# EAGLE design AVR_mainboardV11 (EAGLE 5.07)
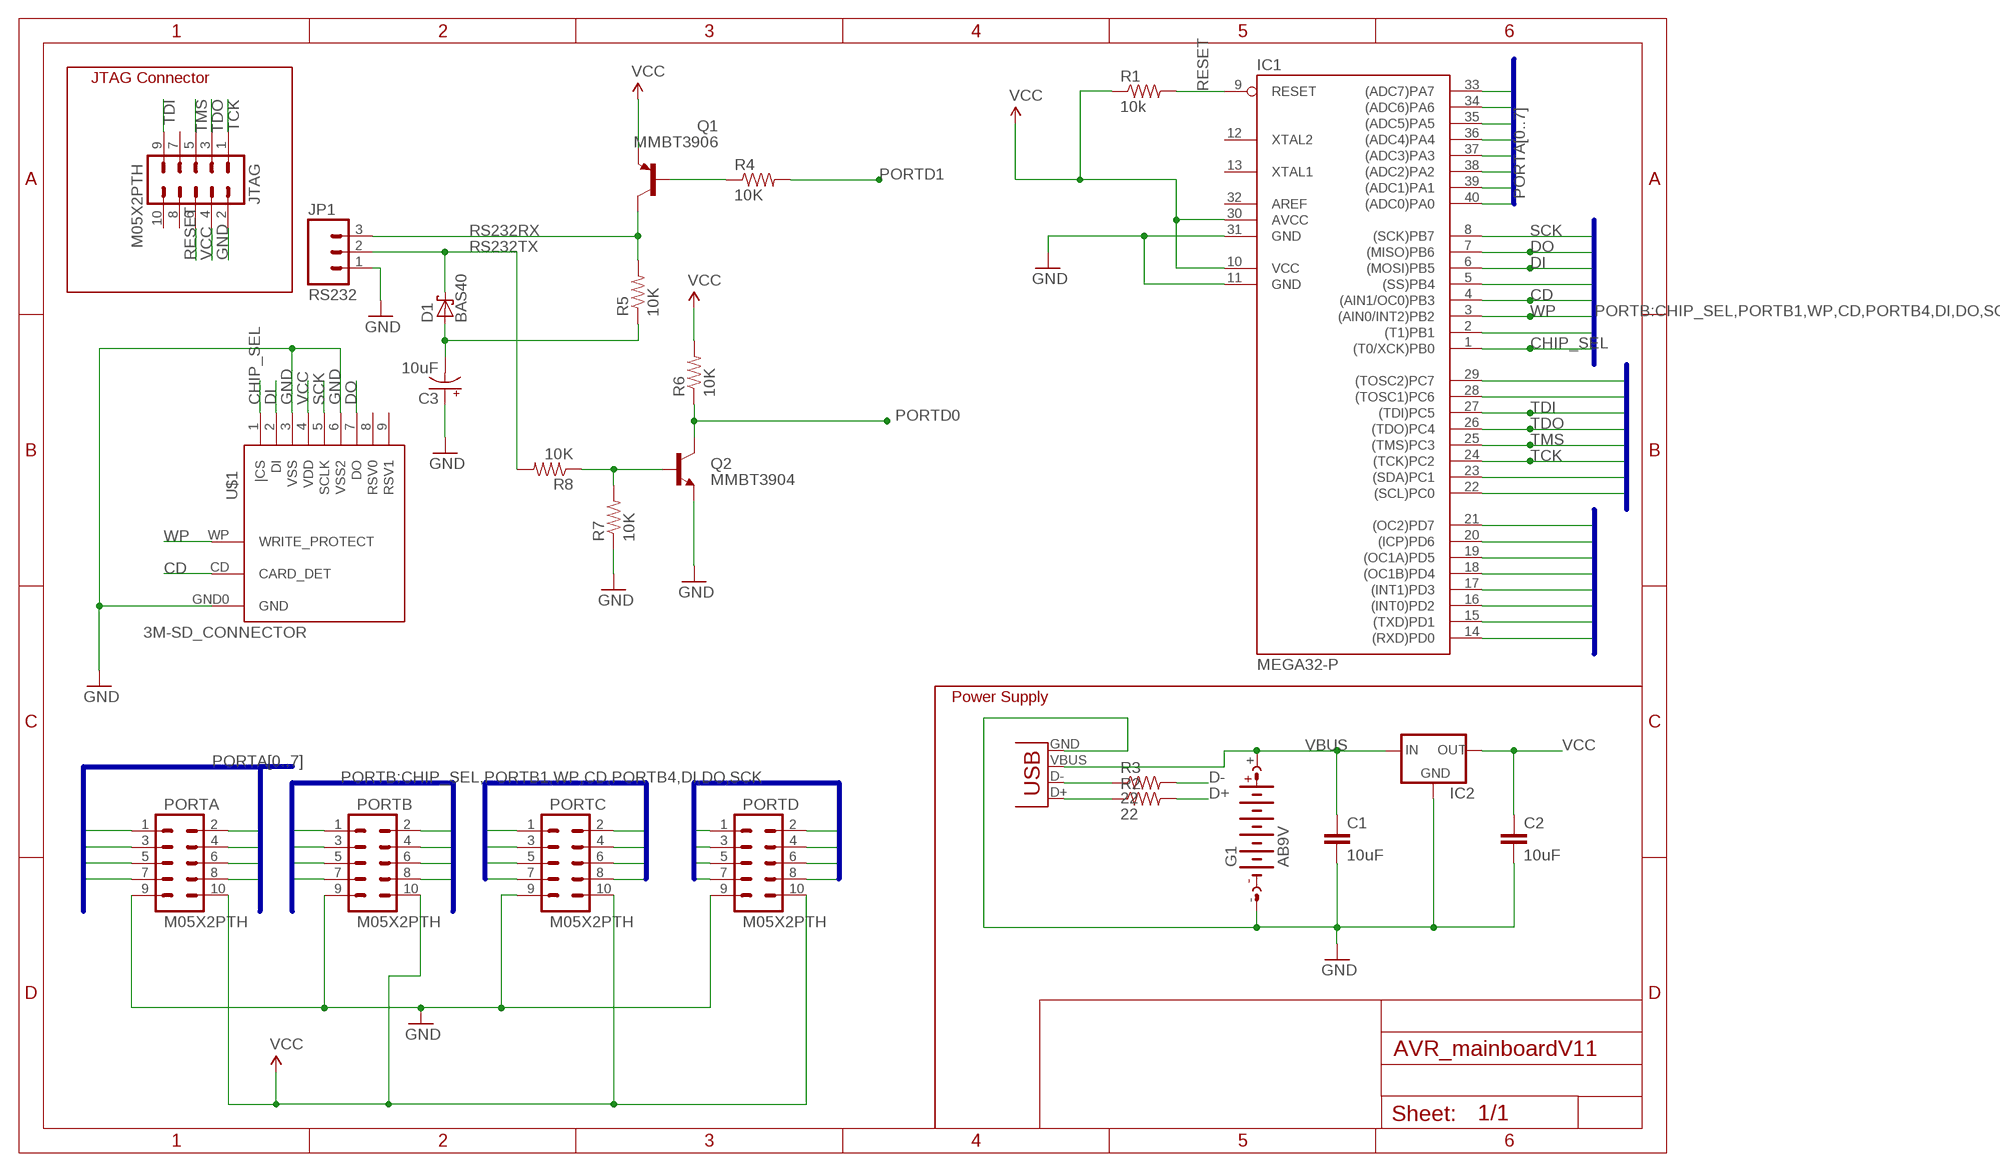
[diagram p0: schematic, sheet 1]

## Parts
C1  10uF  CAPSMD  [GRM43D]
C2  10uF  CAPSMD  [GRM43D]
C3  10uF  CAP_POLPTH2  [CPOL-RADIAL-10UF-25V]
D1  BAS40  [SOT23]
G1  AB9V  [AB9V]
IC1  MEGA32-P  [DIL40]
IC2  3.3V-REGULATOR  [TO220]
JP1  RS232  M03PTH  [1X03]
JTAG  M05X2PTH  [AVR_ICSP]
PORTA  M05X2PTH  [AVR_ICSP]
PORTB  M05X2PTH  [AVR_ICSP]
PORTC  M05X2PTH  [AVR_ICSP]
PORTD  M05X2PTH  [AVR_ICSP]
Q1  MMBT3906  MMBT3906LT1SMD  [SOT23-BEC]
Q2  MMBT3904  TRANSISTOR_NPNSOT23  [SOT23]
R1  10k  RESISTOR1206  [1206]
R2  22  RESISTOR  [0805]
R3  22  RESISTOR  [0805]
R4  10K  RESISTOR1206  [1206]
R5  10K  RESISTOR1206  [1206]
R6  10K  RESISTOR1206  [1206]
R7  10K  RESISTOR1206  [1206]
R8  10K  RESISTOR1206  [1206]
U$1  3M-SD_CONNECTOR  [3M-HC07814A]
X1  USBPTH  [USB-B-PTH]

## Nets
CD: IC1.4((AIN1/OC0)PB3) PORTB.4 U$1.CD(CARD_DET)
CHIP_SEL: IC1.1((T0/XCK)PB0) PORTB.1 U$1.1(|CS)
D+: R2.2
D+.: R2.1 X1.D+
D-: R3.2
D-.: R3.1 X1.D-
DI: IC1.6((MOSI)PB5) PORTB.6 U$1.2(DI)
DO: IC1.7((MISO)PB6) PORTB.7 U$1.7(DO)
GND: C1.C C2.C C3.1(+) G1.- IC1.11(GND) IC1.31(GND) IC2.1(GND) JP1.1 JTAG.2 PORTA.9 PORTB.9 PORTC.9 PORTD.9 Q2.2(E) R7.1 U$1.3(VSS) U$1.6(VSS2) U$1.GND0(GND) X1.GND
N$1: Q1.B R4.1
N$2: Q2.1(B) R7.2 R8.1
N$3: C3.2(-) D1.1(A) R5.1
PORTA0: IC1.40((ADC0)PA0) PORTA.1
PORTA1: IC1.39((ADC1)PA1) PORTA.2
PORTA2: IC1.38((ADC2)PA2) PORTA.3
PORTA3: IC1.37((ADC3)PA3) PORTA.4
PORTA4: IC1.36((ADC4)PA4) PORTA.5
PORTA5: IC1.35((ADC5)PA5) PORTA.6
PORTA6: IC1.34((ADC6)PA6) PORTA.7
PORTA7: IC1.33((ADC7)PA7) PORTA.8
PORTB1: IC1.2((T1)PB1) PORTB.2
PORTB4: IC1.5((SS)PB4) PORTB.5
PORTC0: IC1.22((SCL)PC0) PORTC.1
PORTC1: IC1.23((SDA)PC1) PORTC.2
PORTC6: IC1.28((TOSC1)PC6) PORTC.7
PORTC7: IC1.29((TOSC2)PC7) PORTC.8
PORTD0: IC1.14((RXD)PD0) PORTD.1 Q2.3(C) R6.1
PORTD1: IC1.15((TXD)PD1) PORTD.2 R4.2
PORTD2: IC1.16((INT0)PD2) PORTD.3
PORTD3: IC1.17((INT1)PD3) PORTD.4
PORTD4: IC1.18((OC1B)PD4) PORTD.5
PORTD5: IC1.19((OC1A)PD5) PORTD.6
PORTD6: IC1.20((ICP)PD6) PORTD.7
PORTD7: IC1.21((OC2)PD7) PORTD.8
RESET: IC1.9(RESET) JTAG.6 R1.2
RS232RX: JP1.3 Q1.C R5.2
RS232TX: D1.3(C) JP1.2 R8.2
SCK: IC1.8((SCK)PB7) PORTB.8 U$1.5(SCLK)
TCK: IC1.24((TCK)PC2) JTAG.1 PORTC.3
TDI: IC1.27((TDI)PC5) JTAG.9 PORTC.6
TDO: IC1.26((TDO)PC4) JTAG.3 PORTC.5
TMS: IC1.25((TMS)PC3) JTAG.5 PORTC.4
VBUS: C1.A G1.+ IC2.3(IN) X1.VBUS
VCC: C2.A IC1.10(VCC) IC1.30(AVCC) IC2.2(OUT) JTAG.4 PORTA.10 PORTB.10 PORTC.10 PORTD.10 Q1.E R1.1 R6.2 U$1.4(VDD)
WP: IC1.3((AIN0/INT2)PB2) PORTB.3 U$1.WP(WRITE_PROTECT)
Unconnected: IC1.12(XTAL2) IC1.13(XTAL1) IC1.32(AREF) JTAG.7 JTAG.8 JTAG.10 U$1.8(RSV0) U$1.9(RSV1)

## Buses
PORTA[0..7]
PORTB:CHIP_SEL,PORTB1,WP,CD,PORTB4,DI,DO,SCK
PORTC:PORTC0,PORTC1,TCK,TMS,TDO,TDI,PORTC6,PORTC7
PORTD[0..7]

## Notes on the sheet
- JTAG Connector
- Power Supply

## Library data of the parts
C1 C2 = SparkFun:CAP: Capacitor Standard 0603 ceramic capacitor, and 0.1" leaded capacitor.
C3 = SparkFun:CAP_POL: Capacitor Polarized These are standard SMD and PTH capacitors. Normally 10uF, 47uF, and 100uF in electrolytic and tantalum varieties. Always verify the external diameter of the through hole cap, it varies with capacity, voltage, and manufacturer. The EIA devices should be standard.
D1 = diode:BAS40: Silicon Schottky Diodes General-purpose diode for high-speed switching
G1 = battery:AB9V: 9-V BATTERY CLIP
IC1 = atmel:MEGA32-P: MICROCONTROLLER 32 Kbytes FLASH 2 Kbytes SRAM 1 Kbytes EEPROM USART 8-channel 10 bit ADC Source: www.atmel.com .. doc2503.pdf
IC2 = SparkFun:3.3V-REGULATOR
JP1 = SparkFun:M03: Header 3 Standard 3-pin 0.1" header. Use with straight break away headers (SKU : PRT-00116), right angle break away headers (PRT-00553), swiss pins (PRT-00743), machine pins (PRT-00117), and female headers (PRT-00115). Molex polarized connector foot print use with SKU : PRT-08232 with associated crimp pins and housings.
JTAG PORTA PORTB PORTC PORTD = SparkFun:M05X2: Header 5x2 Standard 10-pin dual row 0.1" header. Commonly used with AVR-ISP. Use with Spark Fun Electronics SKU: PRT-00778
Q1 = transistor-pnp:MMBT3906*: PNP Transistror
Q2 = SparkFun:TRANSISTOR_NPN: Transistor NPN BJT configuration in SOT23 package. MMBT2222 is the common NPN we use. Double check BCE configuration again layout.
R1-R8 = SparkFun:RESISTOR: Resistor Basic schematic elements and footprints for 0603, 1206, and PTH 1/10th watt (small) resistors.
U$1 = ivar:3M-SD_CONNECTOR
X1 = SparkFun:USB: USB Connectors USB-B-PTH is fully proven SKU : PRT-00139 USB-miniB is fully proven SKU : PRT-00587 USB-A-PCB is untested. USB-A-H is throughly reviewed, but untested. Spark Fun Electronics SKU : PRT-00437 USB-B-SMT is throughly reviewed, but untested. Needs silkscreen touching up. USB-A-S has not been used/tested USB-MB-H has not been used/tested

## Board
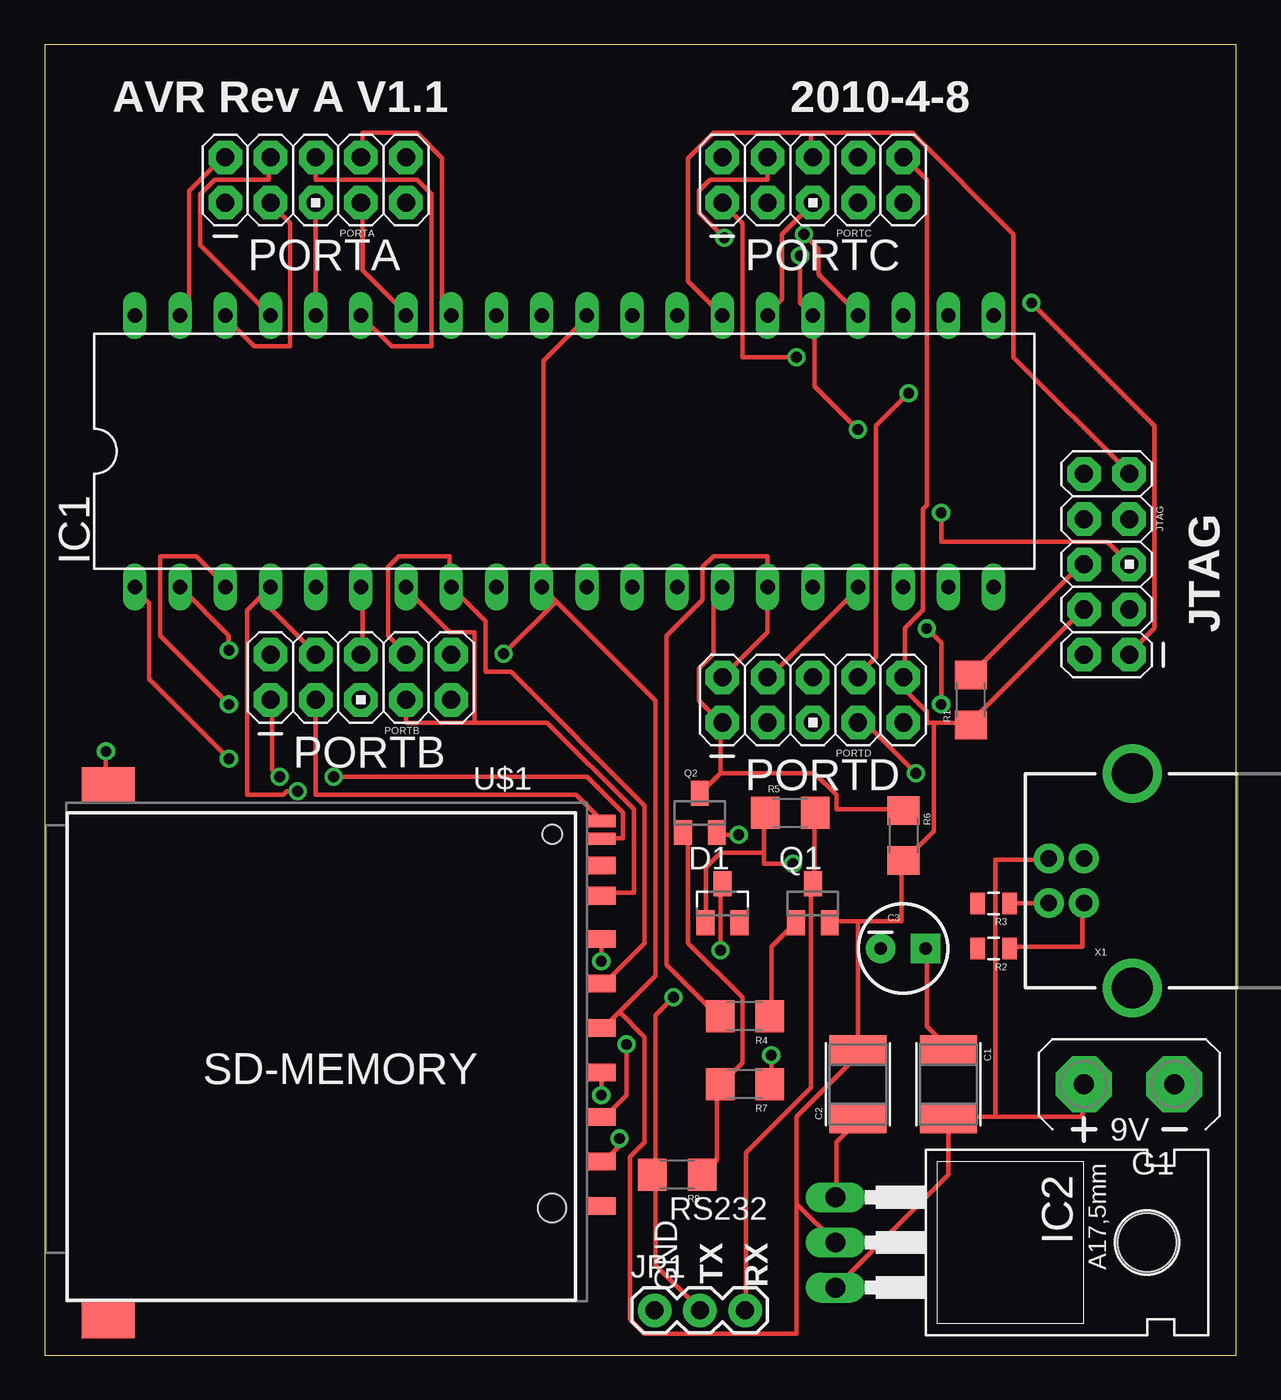
[diagram p1: board, top side]
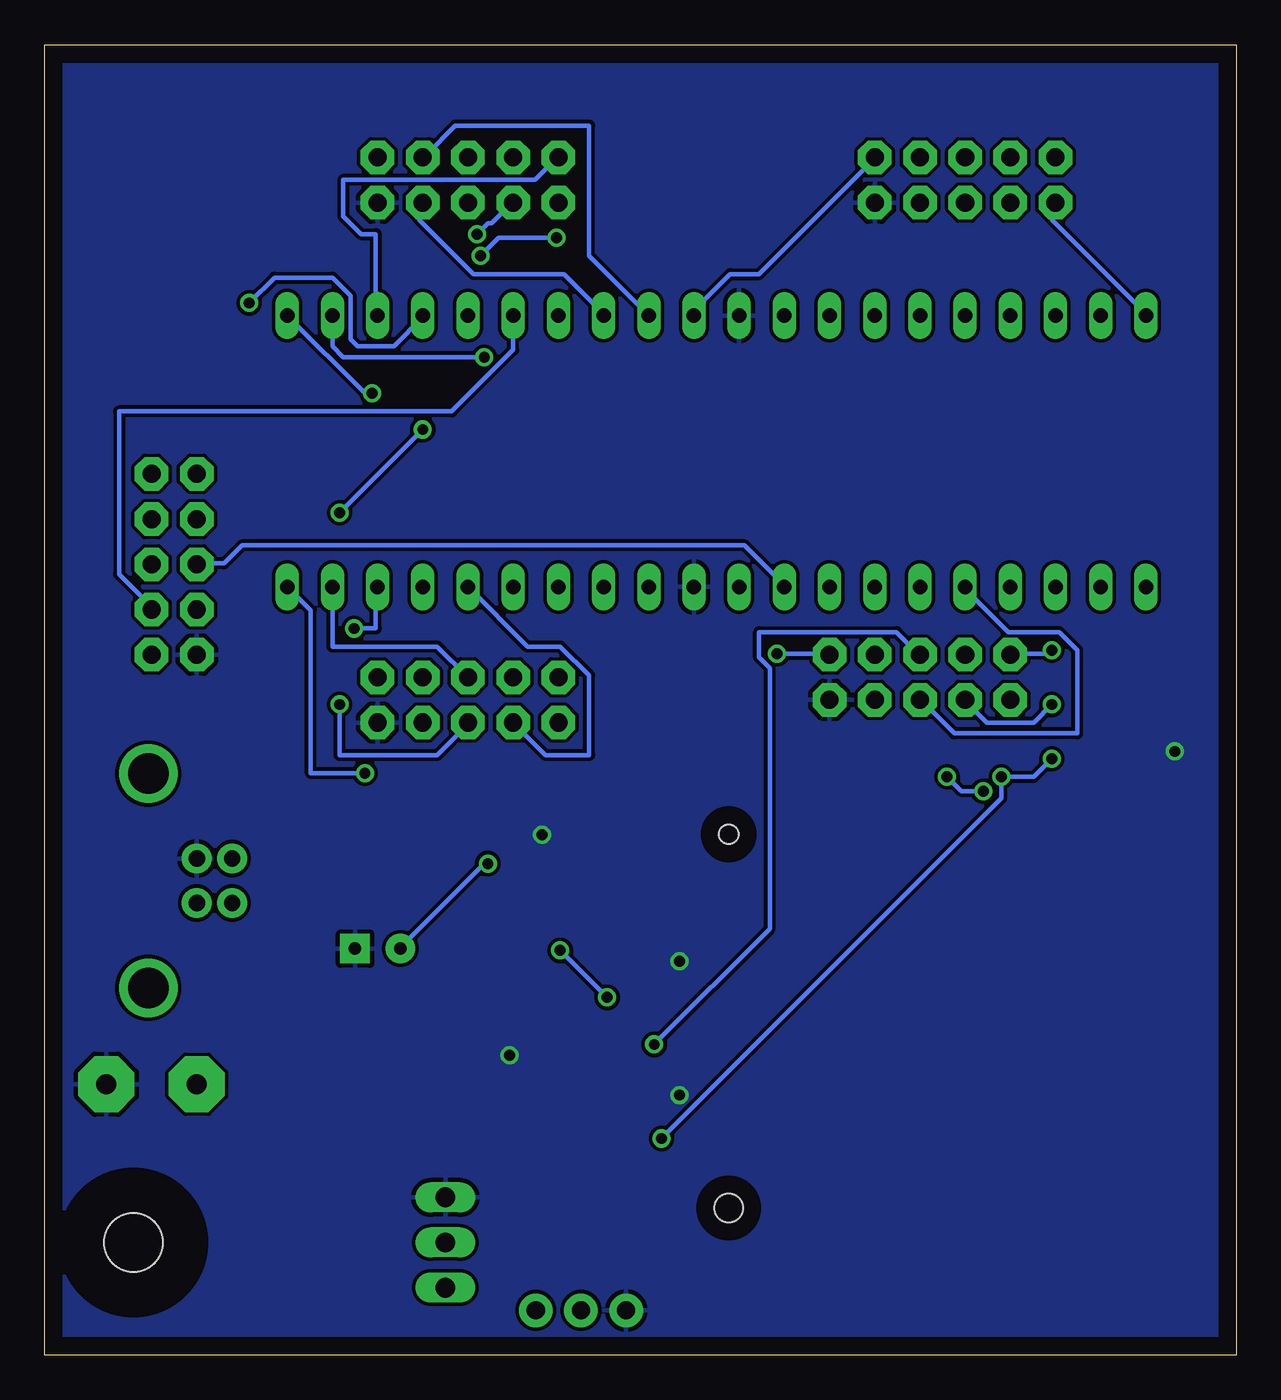
[diagram p2: board, bottom side, seen from below]

Size 66.98 x 73.65 mm. Coordinates in mm from the lower left corner, seen from the top.
Outline: 0,0 66.98,0 66.98,73.65 0,73.65 0,0
Copper layers (1*16): Top 0.035mm / dielectric 1.5mm / Bottom 0.035mm
Design rules "default": minimum track width 10mil, minimum drill 24mil, track to track 8mil, track to pad 8mil, pad to pad 8mil, via to via 8mil, smd to smd 8mil, copper to edge 40mil, drill to drill 8mil, minimum pad ring 10mil, minimum via ring 8mil, stop-mask expansion 4mil, vias tented up to drill 0mil, thermal gap 10mil

### Footprints (pad centres in the part's own frame; a part is rotated, then mirrored left to right if it is on the bottom)
GRM43D = smd 1.65 x 3.2: A 1.927,0; C -1.927,0
CPOL-RADIAL-10UF-25V = drill 0.7 pad 1.651 square: 1 1.27,0 | drill 0.7 pad 1.651 round: 2 -1.27,0
SOT23 = smd 1 x 1.4: 1 -0.95,-1.1; 2 0.95,-1.1; 3 0,1.1
AB9V = drill 1.118 pad 3.15 octagon: + 0,2.54; - 0,-2.54
DIL40 = drill 0.813 long: 1 -24.13,-7.62; 2 -21.59,-7.62; 3 -19.05,-7.62; 4 -16.51,-7.62; 5 -13.97,-7.62; 6 -11.43,-7.62; 7 -8.89,-7.62; 8 -6.35,-7.62; 9 -3.81,-7.62; 10 -1.27,-7.62; 11 1.27,-7.62; 12 3.81,-7.62; 13 6.35,-7.62; 14 8.89,-7.62; 15 11.43,-7.62; 16 13.97,-7.62; 17 16.51,-7.62; 18 19.05,-7.62; 19 21.59,-7.62; 20 24.13,-7.62; 21 24.13,7.62; 22 21.59,7.62; 23 19.05,7.62; 24 16.51,7.62; 25 13.97,7.62; 26 11.43,7.62; 27 8.89,7.62; 28 6.35,7.62; 29 3.81,7.62; 30 1.27,7.62; 31 -1.27,7.62; 32 -3.81,7.62; 33 -6.35,7.62; 34 -8.89,7.62; 35 -11.43,7.62; 36 -13.97,7.62; 37 -16.51,7.62; 38 -19.05,7.62; 39 -21.59,7.62; 40 -24.13,7.62
TO220 = drill 1.118 long: 1 -2.54,-6.35; 2 0,-6.35; 3 2.54,-6.35 | hole 3.302: 0,11.176
1X03 = drill 1.016 pad 1.88 round: 1 0,0; 2 2.54,0; 3 5.08,0
AVR_ICSP = drill 1.016 pad 1.88 octagon: 1 -1.27,5.08; 2 1.27,5.08; 3 -1.27,2.54; 4 1.27,2.54; 5 -1.27,0; 6 1.27,0; 7 -1.27,-2.54; 8 1.27,-2.54; 9 -1.27,-5.08; 10 1.27,-5.08
SOT23-BEC = smd 1 x 1.4: B -0.95,-1.1; C 0,1.1; E 0.95,-1.1
1206 = smd 1.6 x 1.8: 1 -1.4,0; 2 1.4,0
0805 = smd 0.8 x 1.2: 1 -0.9,0; 2 0.9,0
3M-HC07814A = smd 1 x 1.5: 1 6.88,26.25; 2 4.38,26.25; 3 1.88,26.25; 4 -0.62,26.25; 5 -3.12,26.25; 6 -5.62,26.25; 7 -8.05,26.25; 8 -9.75,26.25; 9 9.38,26.25 | smd 0.7 x 1.5: CD -11.25,26.25; WP -12.25,26.25 | smd 2 x 3: GND0 -14.28,-1.5; GND1 15.82,-1.5 | hole 1.1: -11.5,23.45 | hole 1.6: 9.5,23.45
USB-B-PTH = drill 0.914 pad 1.676 round: D+ 0,1.25; D- 1.981,1.25; GND 0,-1.25; VBUS 1.981,-1.25 | drill 2.286 round: P$1 -2.718,-6.02; P$2 -2.718,6.02

### Placement (x,y rotation side)
C1  50.8,15.24 270 top
C2  45.72,15.24 90 top
C3  48.26,22.86 0 top
D1  38.1,25.4 0 top
G1  60.96,15.24 90 top
IC1  29.21,50.8 0 top
IC2  50.8,6.35 270 top
JP1  34.29,2.54 0 top
JTAG  59.69,44.45 180 top
PORTA  15.24,66.04 90 top
PORTB  17.78,38.1 90 top
PORTC  43.18,66.04 90 top
PORTD  43.18,36.83 90 top
Q1  43.18,25.4 0 top
Q2  36.83,30.48 0 top
R1  52.07,36.83 90 top
R2  53.34,22.86 180 top
R3  53.34,25.4 180 top
R4  39.37,19.05 180 top
R5  41.91,30.48 0 top
R6  48.26,29.21 270 top
R7  39.37,15.24 180 top
R8  35.56,10.16 180 top
U$1  5.08,17.78 270 top
X1  58.42,26.67 180 top

### Tracks (layer width: path | path; a pad name or v marks a point on that pad's centre or on a via)
CD  (via drill 0.61)
  Top 0.254: v16.26,32.51 30.48,32.51 32.51,30.48 32.51,29.06 31.5,29.06 U$1.CD | v14.22,31.7 13.61,31.7 13.41,31.5 11.38,31.5 11.38,41.86 12.19,42.67 | 12.19,42.67 IC1.4 12.6,43.08 | 12.19,42.67 12.19,42.47 15.24,39.42 PORTB.4
  Bottom 0.254: v16.26,32.51 15.44,31.7 v14.22,31.7
CHIP_SEL  (via drill 0.61)
  Top 0.254: v32.31,12.19 32.31,11.79 31.5,10.97 U$1.1 | v13.21,32.51 12.8,32.92 12.8,36.78 PORTB.1 | v10.36,33.53 5.89,38 5.89,42.27 5.08,43.08 IC1.1
  Bottom 0.254: v32.31,12.19 13.21,31.29 v13.21,32.51 11.38,32.51 v10.36,33.53
D+.
  Top 0.254: R2.1 54.25,22.96 58.32,22.96 58.32,25.4 X1.D+
D-.
  Top 0.254: R3.1 56.29,25.4 X1.D-
DI  (via drill 0.61)
  Top 0.254: v32.72,17.48 32.72,14.63 31.5,13.41 U$1.2 | IC1.6 17.88,43.08 17.88,39.42 PORTB.6
  Bottom 0.254: v32.72,17.48 26.21,23.98 26.21,38.61 26.82,39.22 26.82,40.64 19.1,40.64 17.88,39.42 PORTB.6
DO
  Top 0.254: 24.18,35.56 20.32,35.56 PORTB.7 | 24.18,35.56 28.25,35.56 33.12,30.68 33.12,26.01 31.5,26.01 U$1.7 | 24.18,35.56 24.18,40.64 22.76,40.64 20.32,43.08 IC1.7
GND  (via drill 0.61)
  Top 0.254: v39.01,29.26 37.8,29.26 Q2.2 | v31.29,14.63 31.29,15.85 U$1.3 | v31.29,22.15 31.29,23.37 U$1.6 | v40.84,16.87 40.84,15.24 R7.1 | v3.45,33.93 3.45,32.11 U$1.GND0 | C2.C 45.72,13.21 44.5,11.99 44.5,8.94 IC2.1 | C1.C 50.8,17.27 49.58,18.49 49.58,22.76 C3.1
  pour Bottom: 0,73.66 67.31,73.66 67.31,0 0,0
N$1
  Top 0.254: Q1.B 42.06,24.18 40.84,22.96 40.84,19.1 R4.1
N$2
  Top 0.254: Q2.1 35.97,29.26 36.17,29.06 36.17,23.16 39.22,20.12 39.22,16.46 38,15.24 R7.2 37.8,15.24 37.8,10.97 36.98,10.16 R8.1
N$3  (via drill 0.61)
  Top 0.254: 40.44,28.25 38,28.25 37.19,27.43 37.19,24.38 D1.1 | 40.44,28.25 40.44,30.48 R5.1 | v42.06,27.64 40.44,27.64 40.44,28.25
  Bottom 0.254: v42.06,27.64 42.27,27.64 46.94,22.96 C3.2
PORTA0
  Bottom 0.254: IC1.40 5.08,58.52 10.36,63.8 10.36,64.62 10.16,64.62 PORTA.1
PORTA1
  Top 0.254: IC1.39 8.13,58.93 8.13,65.43 10.16,67.46 PORTA.2
PORTA2
  Top 0.254: IC1.38 10.16,58.32 11.79,56.69 13.82,56.69 13.82,63.6 12.8,64.62 PORTA.3
PORTA3
  Top 0.254: IC1.37 8.74,62.38 8.74,65.23 9.55,66.04 12.6,66.04 12.6,67.26 PORTA.4
PORTA4
  Top 0.254: IC1.36 PORTA.5
PORTA5
  Top 0.254: IC1.35 19.51,56.69 21.74,56.69 21.74,65.23 20.93,66.04 15.24,66.04 PORTA.6
PORTA6
  Top 0.254: IC1.34 20.32,58.52 17.88,60.96 17.88,64.62 PORTA.7
PORTA7
  Top 0.254: IC1.33 22.35,58.93 22.35,67.26 20.93,68.68 17.88,68.68 17.88,67.46 PORTA.8
PORTB1  (via drill 0.61)
  Top 0.254: v10.36,39.62 10.36,40.44 IC1.2
  Bottom 0.254: v10.36,39.62 10.57,39.42 12.6,39.42 PORTB.2
PORTB4
  Bottom 0.254: IC1.5 15.24,43.08 12.8,40.64 9.96,40.64 8.94,39.62 8.94,34.95 15.85,34.95 17.68,36.78 PORTB.5
PORTC0  (via drill 0.61)
  Top 0.254: v42.27,56.08 39.22,56.08 39.22,63.6 38.2,64.62 PORTC.1
  Bottom 0.254: v42.27,56.08 50.19,56.08 50.8,56.69 IC1.22
PORTC1
  Bottom 0.254: IC1.23 48.36,58.52 48.36,62.99 49.17,62.99 50.19,64.01 50.19,66.04 39.42,66.04 38.2,67.26 PORTC.2
PORTC6
  Bottom 0.254: IC1.28 35.56,58.52 37.8,60.76 42.88,60.76 45.92,63.8 45.92,64.62 45.72,64.62 PORTC.7
PORTC7
  Bottom 0.254: IC1.29 36.37,61.77 36.37,69.09 43.89,69.09 45.52,67.46 45.72,67.46 PORTC.8
PORTD0
  Top 0.254: 38,32.72 36.98,31.7 Q2.3 | 38,32.72 38,35.56 | 38,32.72 43.28,32.72 44.5,31.5 44.5,30.68 48.16,30.68 R6.1 | 38,35.56 36.78,36.78 36.78,38.61 37.59,39.42 37.59,42.67 IC1.14 | 38,35.56 PORTD.1
PORTD1
  Top 0.254: R4.2 37.8,19.1 34.95,21.95 34.95,40.44 36.98,42.47 36.98,44.3 37.59,44.91 40.64,44.91 IC1.15 40.64,40.64 PORTD.2
PORTD2
  Bottom 0.254: PORTD.3 38.81,33.73 36.37,33.73 36.37,38.2 38,39.83 39.83,39.83 IC1.16
PORTD3
  Top 0.254: IC1.17 45.72,43.08 40.64,38 PORTD.4
PORTD4  (via drill 0.61)
  Top 0.254: v49.58,40.84 50.39,40.03 v50.39,36.58
  Bottom 0.254: v49.58,40.84 48.36,40.84 48.36,43.08 IC1.18 | v50.39,36.58 50.39,33.73 44.91,33.73 43.08,35.56 PORTD.5
PORTD5
  Bottom 0.254: IC1.19 50.8,39.83 44.91,39.83 PORTD.6
PORTD6  (via drill 0.61)
  Top 0.254: v48.97,32.72 46.13,35.56 PORTD.7
  Bottom 0.254: v48.97,32.72 52.02,32.72 52.02,41.86 IC1.20
PORTD7  (via drill 0.61)
  Top 0.254: v48.56,54.05 46.74,52.22 46.74,39.22 45.72,38.2 PORTD.8
  Bottom 0.254: v48.56,54.05 48.97,54.05 IC1.21
RESET
  Top 0.254: R1.2 52.22,38.41 58.32,44.5 JTAG.6
  Bottom 0.254: IC1.9 25.4,43.28 27.64,45.52 55.88,45.52 56.9,44.5 58.32,44.5 JTAG.6
RS232RX
  Top 0.254: R5.2 43.28,30.48 43.28,26.62 Q1.C 43.08,26.42 43.08,15.04 39.42,11.38 39.42,2.64 JP1.3
RS232TX  (via drill 0.61)
  Top 0.254: v38,22.76 38,26.42 D1.3 | v35.36,20.12 34.34,19.1 34.34,10.16 | 34.34,10.16 34.34,5.08 36.78,2.64 JP1.2 | 34.34,10.16 R8.2
  Bottom 0.254: v35.36,20.12 v38,22.76
SCK
  Top 0.254: U$1.5 31.5,20.93 33.73,23.16 33.73,30.89 26.21,38.41 24.79,38.41 24.79,41.25 IC1.8 22.76,43.28 22.76,44.91 19.91,44.91 19.3,44.3 19.3,40.44 20.32,39.42 PORTB.8
TCK  (via drill 0.61)
  Top 0.254: v42.67,62.99 43.48,62.18 43.48,60.76 45.72,58.52 IC1.24 | v55.47,59.13 62.38,52.22 62.38,40.84 60.96,39.42 JTAG.1
  Bottom 0.254: v42.67,62.99 42.06,63.6 41.86,63.6 40.84,64.62 40.64,64.62 PORTC.3 | v55.47,59.13 54.05,60.55 50.8,60.55 49.78,59.54 49.78,57.1 49.38,56.69 47.35,56.69 45.72,58.32 IC1.24
TDI
  Top 0.254: 43.08,68.68 37.59,68.68 36.17,67.26 36.17,60.35 IC1.27 | 43.08,68.68 43.08,67.46 PORTC.6 | 43.08,68.68 48.77,68.68 54.46,62.99 54.46,56.08 60.96,49.58 JTAG.9
TDO
  Top 0.254: IC1.26 40.64,58.52 41.45,59.33 41.45,62.99 43.08,64.62 PORTC.5
  Bottom 0.254: JTAG.3 60.96,42.06 62.79,43.89 62.79,53.03 44.09,53.03 40.64,56.49 IC1.26
TMS  (via drill 0.61)
  Top 0.254: v42.47,61.77 42.47,59.13 IC1.25 43.28,58.32 43.28,54.46 v45.72,52.02 | v38.2,62.79 36.78,64.21 36.78,65.43 37.39,66.04 40.64,66.04 PORTC.4 | v50.39,47.35 50.39,45.72 59.74,45.72 60.96,44.5 JTAG.5
  Bottom 0.254: v42.47,61.77 41.45,62.79 v38.2,62.79 | v50.39,47.35 v45.72,52.02
VBUS
  Top 0.254: 53.44,13.41 58.32,13.41 58.32,15.24 G1.+ | 53.44,13.41 50.8,13.41 C1.A 50.8,10.16 IC2.3 | 53.44,13.41 53.44,27.84 56.29,27.84 X1.VBUS
VCC  (via drill 0.61)
  Top 0.254: 32.31,19.3 34.34,21.34 34.34,36.78 28.65,42.47 | 32.31,19.3 31.5,18.49 U$1.4 | 28.65,42.47 IC1.10 28.04,43.28 28.04,55.88 30.48,58.32 IC1.30 | v25.81,39.42 28.65,42.27 28.65,42.47 | 45.72,24.38 48.16,24.38 48.16,27.64 R6.2 48.36,27.84 49.99,29.46 49.99,35.56 | 45.72,24.38 44.3,24.38 Q1.E | 45.72,24.38 C2.A 45.72,16.87 42.27,13.41 42.27,8.53 | 42.27,8.53 IC2.2 | 49.99,35.56 49.58,35.56 49.58,36.17 48.36,37.39 48.36,38 PORTD.10 48.36,38.2 48.36,40.84 49.38,41.86 49.38,47.55 49.58,47.75 49.58,66.04 48.36,67.26 PORTC.10 | 49.99,35.56 52.02,35.56 R1.1 52.22,35.56 52.22,35.76 58.32,41.86 JTAG.4 | 32.31,19.3 33.73,17.88 33.73,11.99 32.92,11.18 32.92,2.03 33.73,1.22 42.27,1.22 42.27,8.53
  Bottom 0.254: v25.81,39.42 22.96,39.42 PORTB.10 | PORTA.10 20.32,67.26 26.82,60.76 28.45,60.76 30.48,58.73 IC1.30
WP  (via drill 0.61)
  Top 0.254: U$1.WP 31.29,30.07 29.87,31.5 15.24,31.5 PORTB.3 | v10.36,36.58 6.5,40.44 6.5,44.91 8.53,44.91 10.16,43.28 IC1.3
  Bottom 0.254: v10.36,36.58 11.38,35.56 14.02,35.56 15.24,36.78 PORTB.3

### Text on the board
tPlace: AVR Rev A V1.1 | 2010-4-8 | PORTA | PORTC | JTAG | PORTB | PORTD | SD-MEMORY | RS232 | GND | TX | RX